# EAGLE design shield_mega_seed4_mpu_lobo5 (EAGLE 6.6.0)
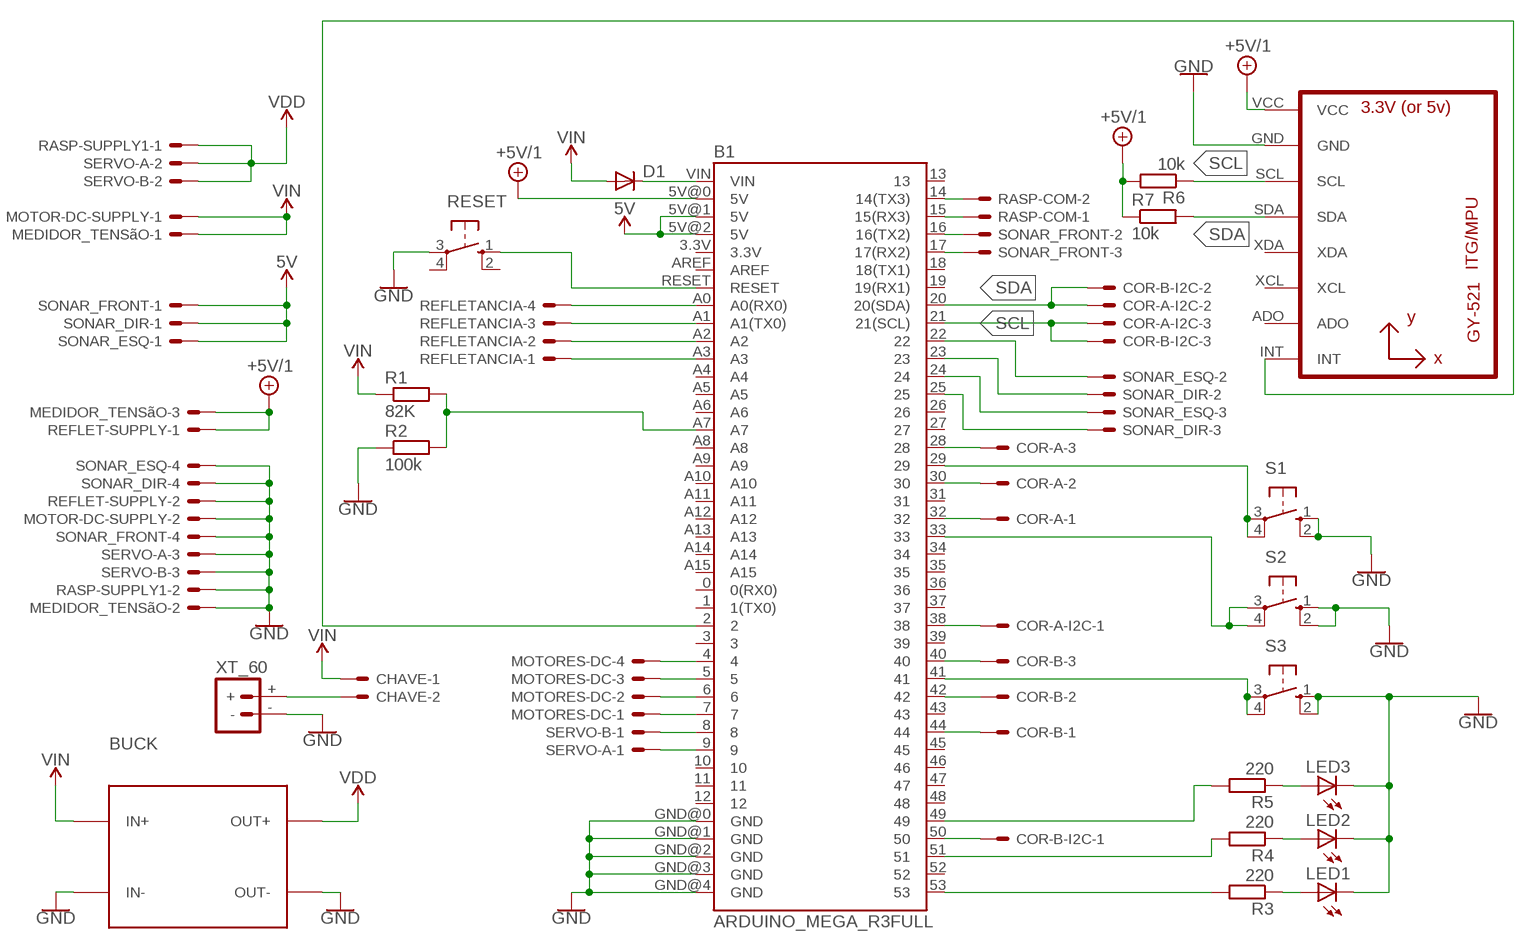
[diagram p0: schematic, sheet 1]

## Parts
B1  ARDUINO_MEGA_R3FULL  [ARDUINO_MEGA]
BUCK  DC-DC-STEP-DOWN-LM2596  [DC-DC-STEP-DOWN-LM2596]
CHAVE  22-23-2021  [22-23-2021]
COR-A  22-23-2031  [22-23-2031]
COR-A-I2C  22-23-2031  [22-23-2031]
COR-B  22-23-2031  [22-23-2031]
COR-B-I2C  22-23-2031  [22-23-2031]
D1  1N4004  [DO41-10]
LED1  LED5MM  [LED5MM]
LED2  LED5MM  [LED5MM]
LED3  LED5MM  [LED5MM]
MEDIDOR_TENSãO  22-23-2031  [22-23-2031]
MOTOR-DC-SUPPLY  22-23-2021  [22-23-2021]
MOTORES-DC  22-23-2041  [22-23-2041]
R1  82K  R-EU_0207/12  [0207/12]
R2  100k  R-EU_0207/12  [0207/12]
R3  220  R-EU_0207/7  [0207/7]
R4  220  R-EU_0207/7  [0207/7]
R5  220  R-EU_0207/7  [0207/7]
R6  10k  R-EU_0204/7  [0204/7]
R7  10k  R-EU_0204/7  [0204/7]
RASP-COM  22-23-2021  [22-23-2021]
RASP-SUPPLY1  22-23-2021  [22-23-2021]
REFLET-SUPPLY  22-23-2021  [22-23-2021]
REFLETANCIA  22-23-2041  [22-23-2041]
RESET  10-XX  [B3F-10XX]
S1  10-XX  [B3F-10XX]
S2  10-XX  [B3F-10XX]
S3  10-XX  [B3F-10XX]
SERVO-A  22-23-2031  [22-23-2031]
SERVO-B  22-23-2031  [22-23-2031]
SONAR_DIR  22-23-2041  [22-23-2041]
SONAR_ESQ  22-23-2041  [22-23-2041]
SONAR_FRONT  22-23-2041  [22-23-2041]
U1  GY-521MPU6050  [GY-521]
XT_60  BATTERY_CONNXT60  [XT60]

## Nets
5V: B1.5V@1(5V) B1.5V@2(5V) SONAR_DIR.1 SONAR_ESQ.1 SONAR_FRONT.1
+5V/1: B1.5V@0(5V) MEDIDOR_TENSãO.3 R6.2 R7.1 REFLET-SUPPLY.1 U1.VCC
GND: B1.GND@0(GND) B1.GND@1(GND) B1.GND@2(GND) B1.GND@3(GND) B1.GND@4(GND) BUCK.IN- BUCK.OUT- LED1.K(C) LED2.K(C) LED3.K(C) MEDIDOR_TENSãO.2 MOTOR-DC-SUPPLY.2 R2.1 RASP-SUPPLY1.2 REFLET-SUPPLY.2 RESET.3(P) S1.1(S) S1.2(S1) S2.1(S) S2.2(S1) S3.1(S) S3.2(S1) SERVO-A.3 SERVO-B.3 SONAR_DIR.4 SONAR_ESQ.4 SONAR_FRONT.4 U1.GND XT_60.-
N$1: B1.A2 REFLETANCIA.2
N$2: B1.A3 REFLETANCIA.1
N$3: B1.4 MOTORES-DC.4
N$4: B1.5 MOTORES-DC.3
N$5: B1.6 MOTORES-DC.2
N$6: B1.7 MOTORES-DC.1
N$7: B1.8 SERVO-B.1
N$8: B1.9 SERVO-A.1
N$9: B1.14(14(TX3)) RASP-COM.2
N$10: B1.15(15(RX3)) RASP-COM.1
N$11: B1.16(16(TX2)) SONAR_FRONT.2
N$12: B1.17(17(RX2)) SONAR_FRONT.3
N$13: CHAVE.2 XT_60.+
N$14: B1.32 COR-A.1
N$15: B1.30 COR-A.2
N$16: B1.38 COR-A-I2C.1
N$17: B1.40 COR-B.3
N$18: B1.42 COR-B.2
N$19: B1.44 COR-B.1
N$20: B1.A7 R1.2 R2.2
N$21: B1.53 R3.2
N$22: B1.51 R4.2
N$23: B1.49 R5.2
N$24: LED3.A R5.1
N$25: LED2.A R4.1
N$26: LED1.A R3.1
N$27: B1.33 S2.3(P) S2.4(P1)
N$28: B1.29 S1.3(P) S1.4(P1)
N$29: B1.A1(A1(TX0)) REFLETANCIA.3
N$30: B1.41 S3.3(P) S3.4(P1)
N$31: B1.RESET RESET.1(S)
N$32: B1.VIN D1.C
N$33: B1.A0(A0(RX0)) REFLETANCIA.4
N$34: B1.25 SONAR_DIR.3
N$35: B1.24 SONAR_ESQ.3
N$36: B1.23 SONAR_DIR.2
N$37: B1.22 SONAR_ESQ.2
N$39: B1.2 U1.INT
N$40: B1.50 COR-B-I2C.1
N$41: B1.28 COR-A.3
SCL: B1.21(21(SCL)) COR-A-I2C.3 COR-B-I2C.3 R6.1 U1.SCL
SDA: B1.20(20(SDA)) COR-A-I2C.2 COR-B-I2C.2 R7.2 U1.SDA
VDD: BUCK.OUT+ RASP-SUPPLY1.1 SERVO-A.2 SERVO-B.2
VIN: BUCK.IN+ CHAVE.1 D1.A MEDIDOR_TENSãO.1 MOTOR-DC-SUPPLY.1 R1.1
Unconnected: B1.0(0(RX0)) B1.1(1(TX0)) B1.3 B1.3.3V B1.10 B1.11 B1.12 B1.13 B1.18(18(TX1)) B1.19(19(RX1)) B1.26 B1.27 B1.31 B1.34 B1.35 B1.36 B1.37 B1.39 B1.43 B1.45 B1.46 B1.47 B1.48 B1.52 B1.A4 B1.A5 B1.A6 B1.A8 B1.A9 B1.A10 B1.A11 B1.A12 B1.A13 B1.A14 B1.A15 B1.AREF RESET.2(S1) RESET.4(P1) U1.ADO U1.XCL U1.XDA

## Library data of the parts
B1 = SparkFun-Boards3:ARDUINO_MEGA_R3: Arduino Mega R3 ATmega2560 R3 compatible footprint. SparkFun Products: Arduino Mega 2560 R3 <https://www.sparkfun.com/products/11061>
BUCK = 1484249208697-powermodules:DC-DC-STEP-DOWN-LM2596: DC/DC Step-Down Regulator based on LM2596-ADJ chip
CHAVE MOTOR-DC-SUPPLY RASP-COM RASP-SUPPLY1 REFLET-SUPPLY = con-molex:22-23-2021: .100" (2.54mm) Center Header - 2 Pin; MF: MOLEX; MPN: 22-23-2021; OC_FARNELL: 1462926; OC_NEWARK: 25C3832
COR-A COR-A-I2C COR-B COR-B-I2C MEDIDOR_TENSãO SERVO-A SERVO-B = con-molex:22-23-2031: .100" (2.54mm) Center Header - 3 Pin; MF: MOLEX; MPN: 22-23-2031; OC_FARNELL: 1462950; OC_NEWARK: 30C0862
D1 = diode:1N4004: DIODE general purpose rectifier, 1 A
LED1-LED3 = led:LED: LED OSRAM: - CHIPLED LG R971, LG N971, LY N971, LG Q971, LY Q971, LO R971, LY R971 LH N974, LH R974 LS Q976, LO Q976, LY Q976 LO Q996 - Hyper CHIPLED LW Q18S LB Q993, LB Q99A, LB R99A - SideLED LS A670, LO A670, LY A670, LG A670, LP A670 LB A673, LV A673, LT A673, LW A673 LH A674 LY A675 LS A676, LA A676, LO A676, LY A676, LW A676 LS A679, LY A679, LG A679 - Hyper Micro SIDELED® LS Y876, LA Y876, LO Y876, LY Y876 LT Y87S - SmartLED LW L88C, LW L88S LB L89C, LB L89S, LG L890 LS L89K, LO L89K, LY L89K LS L896, LA L896, LO L896, LY L896 - TOPLED LS T670, LO T670, LY T670, LG T670, LP T670 LSG T670, LSP T670, LSY T670, LOP T670, LYG T670 LG T671, LOG T671, LSG T671 LB T673, LV T673, LT T673, LW T673 LH T674 LS T676, LA T676, LO T676, LY T676, LB T676, LH T676, LSB T676, LW T676 LB T67C, LV T67C, LT T67C, LS T67K, LO T67K, LY T67K, LW E67C LS E67B, LA E67B, LO E67B, LY E67B, LB E67C, LV E67C, LT E67C LW T67C LS T679, LY T679, LG T679 LS T770, LO T770, LY T770, LG T770, LP T770 LB T773, LV T773, LT T773, LW T773 LH T774 LS E675, LA E675, LY E675, LS T675 LS T776, LA T776, LO T776, LY T776, LB T776 LHGB T686 LT T68C, LB T68C - Hyper Mini TOPLED® LB M676 - Mini TOPLED Santana® LG M470 LS M47K, LO M47K, LY M47K Source: http://www.osram.convergy.de LUXEON: - LUMILED® LXK2-PW12-R00, LXK2-PW12-S00, LXK2-PW14-U00, LXK2-PW14-V00 LXK2-PM12-R00, LXK2-PM12-S00, LXK2-PM14-U00 LXK2-PE12-Q00, LXK2-PE12-R00, LXK2-PE12-S00, LXK2-PE14-T00, LXK2-PE14-U00 LXK2-PB12-K00, LXK2-PB12-L00, LXK2-PB12-M00, LXK2-PB14-N00, LXK2-PB14-P00, LXK2-PB14-Q00 LXK2-PR12-L00, LXK2-PR12-M00, LXK2-PR14-Q00, LXK2-PR14-R00 LXK2-PD12-Q00, LXK2-PD12-R00, LXK2-PD12-S00 LXK2-PH12-R00, LXK2-PH12-S00 LXK2-PL12-P00, LXK2-PL12-Q00, LXK2-PL12-R00 Source: www.luxeon.com KINGBRIGHT: KA-3528ASYC Source: www.kingbright.com
MOTORES-DC REFLETANCIA SONAR_DIR SONAR_ESQ SONAR_FRONT = con-molex:22-23-2041: .100" (2.54mm) Center Header - 4 Pin; MF: MOLEX; MPN: 22-23-2041; OC_FARNELL: 1462920; OC_NEWARK: 38C0355
R1-R7 = rcl:R-EU_: RESISTOR, European symbol
RESET S1-S3 = switch-omron:10-XX: OMRON SWITCH; MPN: B3F-1000; OC_FARNELL: 176432; OC_NEWARK: 36M3542
U1 = gy-521:GY-521
XT_60 = Robotica-IFRN-SC-conectores:BATTERY_CONN: Battery Connectors Various footprints for battery connections

## Board
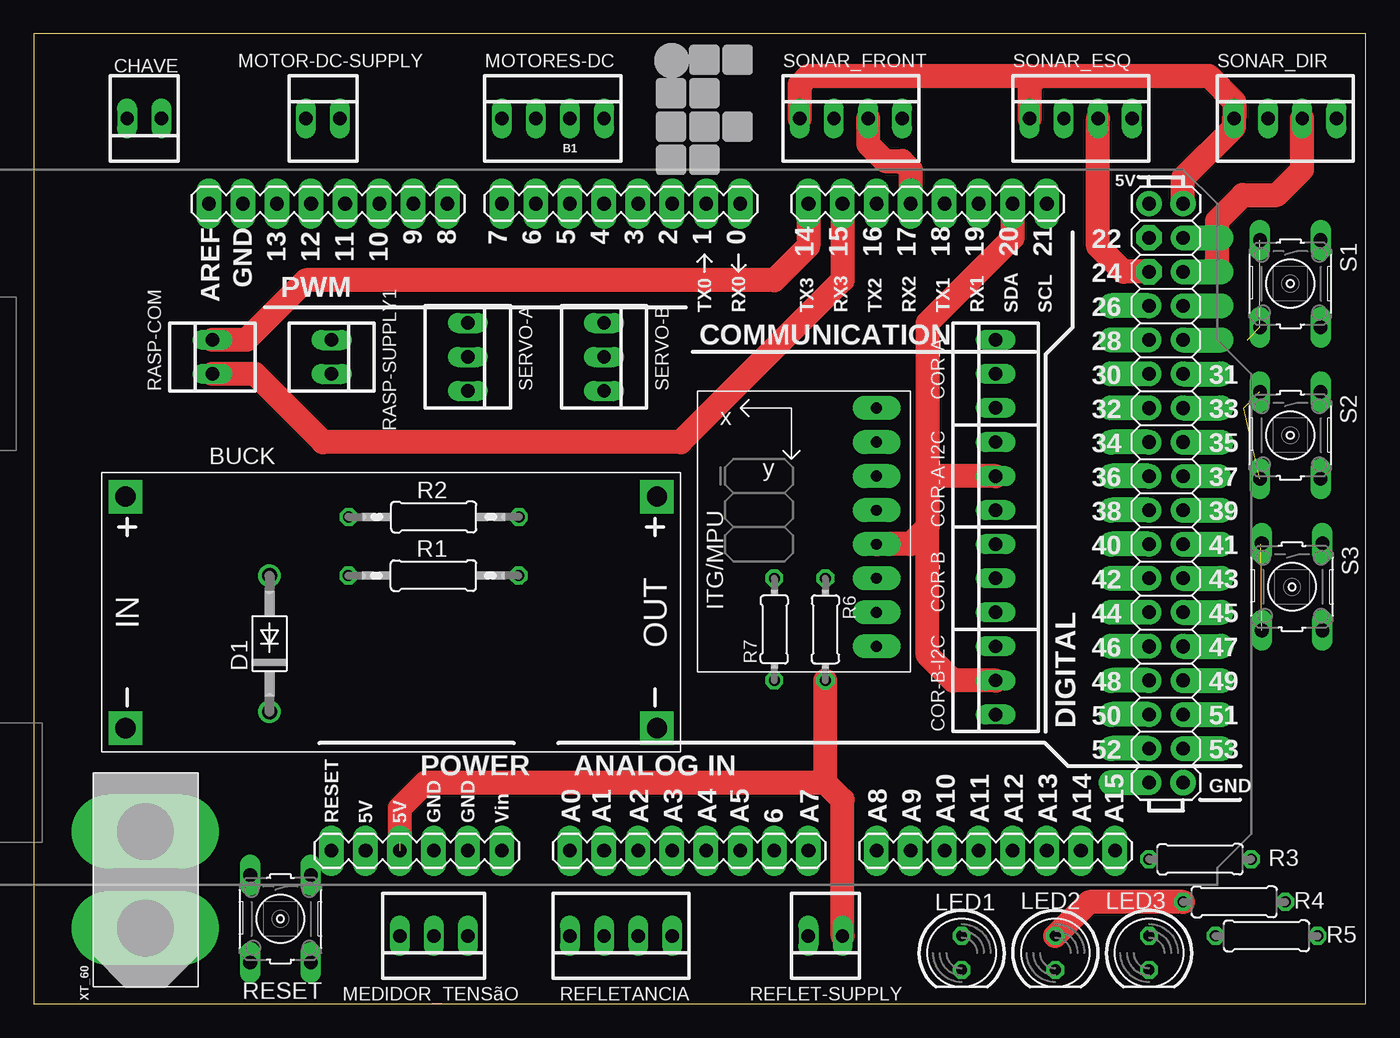
[diagram p1: board, top side]
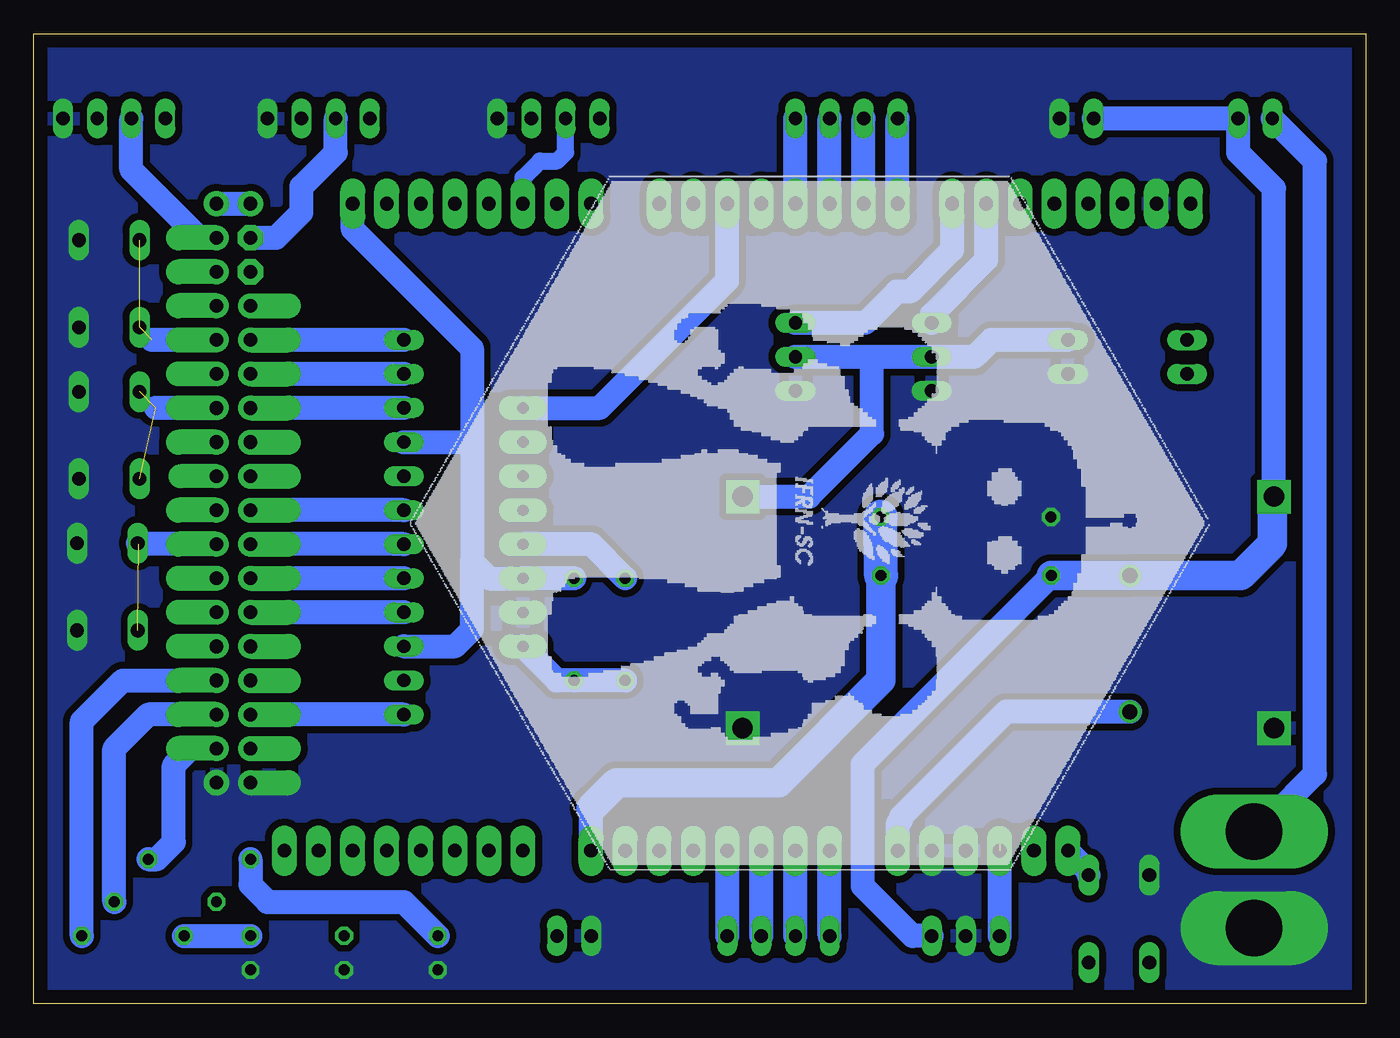
[diagram p2: board, bottom side, seen from below]

Size 99.37 x 72.38 mm. Coordinates in mm from the lower left corner, seen from the top.
Outline: 0,0 99.37,0 99.37,72.38 0,72.38 0,0
Copper layers (1*16): Top 0.035mm / dielectric 1.5mm / Bottom 0.035mm
Design rules "default *": minimum track width 30mil, minimum drill 24mil, track to track 20mil, track to pad 20mil, pad to pad 20mil, via to via 20mil, smd to smd 8mil, copper to edge 40mil, drill to drill 8mil, minimum pad ring 10mil, minimum via ring 8mil, stop-mask expansion 4mil, vias tented up to drill 0mil, thermal gap 0mil

### Footprints (pad centres in the part's own frame; a part is rotated, then mirrored left to right if it is on the bottom)
ARDUINO_MEGA = drill 1.016 pad 1.88 long: 0 13.97,24.13; 1 11.43,24.13; 2 8.89,24.13; 3 6.35,24.13; 3.3V -13.97,-24.13; 4 3.81,24.13; 5 1.27,24.13; 5V@0 -11.43,-24.13; 6 -1.27,24.13; 7 -3.81,24.13; 8 -7.874,24.13; 9 -10.414,24.13; 10 -12.954,24.13; 11 -15.494,24.13; 12 -18.034,24.13; 13 -20.574,24.13; 14 19.05,24.13; 15 21.59,24.13; 16 24.13,24.13; 17 26.67,24.13; 18 29.21,24.13; 19 31.75,24.13; 20 34.29,24.13; 21 36.83,24.13; A0 1.27,-24.13; A1 3.81,-24.13; A2 6.35,-24.13; A3 8.89,-24.13; A4 11.43,-24.13; A5 13.97,-24.13; A6 16.51,-24.13; A7 19.05,-24.13; A8 24.13,-24.13; A9 26.67,-24.13; A10 29.21,-24.13; A11 31.75,-24.13; A12 34.29,-24.13; A13 36.83,-24.13; A14 39.37,-24.13; A15 41.91,-24.13; AREF -25.654,24.13; GND@0 -8.89,-24.13; GND@1 -6.35,-24.13; GND@4 -23.114,24.13; RESET -16.51,-24.13; VIN -3.81,-24.13 | drill 1.016 pad 1.88: 5V@1 44.45,24.13; 5V@2 46.99,24.13; GND@3 46.99,-19.05 | drill 1.016 pad 1.88 octagon: 22 44.45,21.59; 24 44.45,19.05 | drill 1.016 pad 1.88 offset: 23 46.99,21.59; 25 46.99,19.05; 26 44.45,16.51; 27 46.99,16.51; 28 44.45,13.97; 29 46.99,13.97; 30 44.45,11.43; 31 46.99,11.43; 32 44.45,8.89; 33 46.99,8.89; 34 44.45,6.35; 35 46.99,6.35; 36 44.45,3.81; 38 44.45,1.27; 39 46.99,1.27; 40 44.45,-1.27; 41 46.99,-1.27; 42 44.45,-3.81; 43 46.99,-3.81; 44 44.45,-6.35; 45 46.99,-6.35; 46 44.45,-8.89; 47 46.99,-8.89; 48 44.45,-11.43; 49 46.99,-11.43; 50 44.45,-13.97; 51 46.99,-13.97; 52 44.45,-16.51; 53 46.99,-16.51; GND@2 44.45,-19.05 | drill 1 pad 1.778 offset: 37 46.99,3.81
DC-DC-STEP-DOWN-LM2596 = drill 1.5 pad 2.5 square: IN+ -19.812,8.636; IN- -19.812,-8.636; OUT+ 19.812,8.636; OUT- 19.812,-8.636
22-23-2021 = drill 1 long: 1 -1.27,0; 2 1.27,0
22-23-2031 = drill 1 long: 1 -2.54,0; 2 0,0; 3 2.54,0
DO41-10 = drill 1.118: A 5.08,0; C -5.08,0
LED5MM = drill 0.813 octagon: A -1.27,0; K 1.27,0
22-23-2041 = drill 1 long: 1 -3.81,0; 2 -1.27,0; 3 1.27,0; 4 3.81,0
0207/12 = drill 0.813 octagon: 1 -6.35,0; 2 6.35,0
0207/7 = drill 0.813 octagon: 1 -3.81,0; 2 3.81,0
0204/7 = drill 0.813 octagon: 1 -3.81,0; 2 3.81,0
B3F-10XX = drill 1.016 long: 1 -3.251,2.261; 2 3.251,2.261; 3 -3.251,-2.261; 4 3.251,-2.261
GY-521 = drill 0.8 pad 1.778 long: ADO -8.89,-6.35; GND -8.89,6.35; INT -8.89,-8.89; SCL -8.89,3.81; SDA -8.89,1.27; VCC -8.89,8.89; XCL -8.89,-3.81; XDA -8.89,-1.27
XT60 = drill 4.2 pad 5.5 long: + 6.51,-1.35; - -0.69,-1.35

### Placement (x,y rotation side)
B1  38.73,35.56 0 top
BUCK  26.67,29.21 0 top
CHAVE  8.26,66.04 180 top
COR-A  71.76,46.99 90 top
COR-A-I2C  71.76,39.37 90 top
COR-B  71.76,31.75 90 top
COR-B-I2C  71.76,24.13 90 top
D1  17.6,26.87 90 top
LED1  69.22,3.81 270 top
LED2  76.2,3.81 270 top
LED3  83.19,3.81 270 top
MEDIDOR_TENSãO  29.85,5.08 180 top
MOTOR-DC-SUPPLY  21.59,66.04 0 top
MOTORES-DC  38.73,66.04 0 top
R1  29.82,31.95 0 top
R2  29.85,36.32 0 top
R3  87,10.79 0 top
R4  89.54,7.62 0 top
R5  91.95,5.08 0 top
R6  59.05,27.94 270 top
R7  55.24,27.94 90 top
RASP-COM  13.33,48.26 90 top
RASP-SUPPLY1  22.23,48.26 270 top
REFLET-SUPPLY  59.05,5.08 180 top
REFLETANCIA  43.81,5.08 180 top
RESET  18.42,6.35 270 top
S1  93.73,53.72 270 top
S2  93.73,42.42 270 top
S3  93.85,31.12 270 top
SERVO-A  32.38,48.26 270 top
SERVO-B  42.54,48.26 270 top
SONAR_DIR  93.34,66.04 0 top
SONAR_ESQ  78.11,66.04 0 top
SONAR_FRONT  60.96,66.04 0 top
U1  53.98,35.56 180 top
XT_60  6.98,6.35 90 top

### Tracks (layer width: path | path; a pad name or v marks a point on that pad's centre or on a via)
5V
  Top 1.778: B1.5V@2 85.73,61.59 89.54,65.41 SONAR_DIR.1 89.54,67.31 87.63,69.22 74.93,69.22 74.61,68.9 | SONAR_ESQ.1 74.3,68.58 74.61,68.9 | 74.61,68.9 74.3,69.22 57.78,69.22 57.15,68.58 SONAR_FRONT.1
  Bottom 1.778: B1.5V@2 B1.5V@1
+5V/1  (1 unrouted)
  Top 1.778: REFLET-SUPPLY.1 60.32,15.24 59.05,16.51 | 59.05,16.51 29.21,16.51 27.31,14.61 B1.5V@0 | 59.05,16.51 R6.2
  Bottom 1.778: MEDIDOR_TENSãO.3 27.31,12.06 | U1.VCC 60.32,24.13 R6.2 R7.1
GND
  Bottom 1.778: B1.GND@3 85.78,16.46
  pour Bottom: 0.64,72.39 0.64,0 99.06,0 99.06,72.39
N$1
  Bottom 1.778: REFLETANCIA.2 B1.A2
N$2
  Bottom 1.778: REFLETANCIA.1 B1.A3
N$3
  Bottom 1.778: B1.4 MOTORES-DC.4
N$4
  Bottom 1.778: B1.5 MOTORES-DC.3
N$5
  Bottom 1.778: B1.6 MOTORES-DC.2
N$6
  Bottom 1.778: B1.7 MOTORES-DC.1
N$7
  Bottom 1.778: B1.8 30.86,56.26 33.97,53.15 34.99,53.15 37.34,50.8 SERVO-B.1
N$8
  Bottom 1.778: SERVO-A.1 32.38,51.44 28.32,55.5 B1.9
N$9
  Top 1.778: RASP-COM.2 15.88,49.53 20.32,53.98 55.24,53.98 57.78,56.52 B1.14
N$10
  Top 1.778: B1.15 60.32,53.98 48.26,41.91 21.59,41.91 16.51,46.99 RASP-COM.1
N$11
  Bottom 1.27: B1.16 62.86,61.59 61.59,62.86 60.32,62.86 59.69,63.5 SONAR_FRONT.2
N$12
  Top 1.778: SONAR_FRONT.3 62.23,64.14 63.5,62.86 64.77,62.86 65.41,62.23 B1.17
N$13
  Bottom 1.778: 6.98,13.97 3.81,17.14 3.81,62.86 CHAVE.2
  Bottom 1.93: XT_60.+ 6.98,13.97
N$14
  Bottom 1.778: COR-A.1 B1.32
N$15
  Bottom 1.778: COR-A.2 B1.30
N$16
  Bottom 1.778: COR-A-I2C.1 B1.38
N$17
  Bottom 1.778: COR-B.3 B1.40
N$18
  Bottom 1.778: COR-B.2 B1.42
N$19
  Bottom 1.778: COR-B.1 B1.44
N$20
  Bottom 1.778: B1.A7 57.78,14.61
  Bottom 2.184: 57.78,14.61 55.88,16.51 43.81,16.51 36.17,24.16 R1.2
  Bottom 2.54: R1.2 R2.2
N$21
  Bottom 1.778: R3.2 90.17,10.79 88.9,12.06 88.9,17.78 87.63,19.05 B1.53
N$22
  Bottom 1.778: R4.2 93.34,19.05 90.81,21.59 B1.51
N$23
  Bottom 1.778: B1.49 92.71,24.13 95.76,21.08 R5.2
N$24
  Bottom 1.778: R5.1 LED3.A
N$25
  Top 1.778: R4.1 78.74,7.62 LED2.A
N$26
  Bottom 1.778: R3.1 83.19,8.89 81.92,7.62 71.76,7.62 LED1.A
N$27  (2 unrouted)
  Bottom 1.778: B1.33 90.25,44.45
N$28  (2 unrouted)
  Bottom 1.778: B1.29 90.53,49.53
N$29
  Bottom 1.778: REFLETANCIA.3 B1.A1
N$30  (1 unrouted)
  Bottom 1.778: B1.41 91.52,34.29 S3.3
N$31
  Bottom 1.778: B1.RESET 20.96,10.16 RESET.1
N$32
  Bottom 1.778: D1.C 26.85,21.79 34.67,13.97 34.67,13.72 34.92,13.46 B1.VIN
N$33
  Bottom 1.778: REFLETANCIA.4 B1.A0
N$34
  Top 1.778: B1.25 87.63,54.61 88.27,55.25 88.27,58.42 90.17,60.33 92.71,60.33 94.62,62.23 SONAR_DIR.3
N$35
  Top 1.778: B1.24 81.28,54.61 79.38,56.52 SONAR_ESQ.3
N$36
  Bottom 1.778: B1.23 87,57.15 92.08,62.23 SONAR_DIR.2
N$37
  Bottom 1.778: B1.22 81.28,57.15 79.38,59.05 79.38,60.96 76.84,63.5 SONAR_ESQ.2
N$39
  Bottom 1.778: U1.INT 57.15,44.45 47.62,53.98 B1.2
N$40
  Bottom 1.778: COR-B-I2C.1 B1.50
N$41
  Bottom 1.778: COR-A.3 B1.28
SCL
  Bottom 1.778: 66.68,41.91 66.68,48.89 75.57,57.78 B1.21 | 66.68,41.91 66.68,33.02 | 66.68,33.02 65.41,31.75 U1.SCL R6.1 | 66.68,33.02 66.68,27.94 67.95,26.67 COR-B-I2C.3 | COR-A-I2C.3 66.68,41.91
SDA
  Top 1.778: 66.68,39.37 66.68,50.8 73.03,57.15 B1.20 | 66.68,39.37 66.68,35.56 | 66.68,35.56 65.41,34.29 U1.SDA | 66.68,35.56 66.68,26.03 68.58,24.13 COR-B-I2C.2 | COR-A-I2C.2 66.68,39.37
  Bottom 1.778: R7.2 57.78,34.29 U1.SDA
VDD
  Bottom 1.778: RASP-SUPPLY1.1 27.94,49.53 29.21,48.26 SERVO-A.2 36.83,48.26 | 36.83,48.26 SERVO-B.2 | 36.83,48.26 36.83,42.55 41.53,37.85 BUCK.OUT+
VIN
  Bottom 1.778: MOTOR-DC-SUPPLY.1 CHAVE.1 9.53,63.5 6.86,60.83 BUCK.IN+ | MEDIDOR_TENSãO.1 33.81,5.08 37.52,8.79 37.52,17.91 R1.1
  Bottom 2.184: BUCK.IN+ 6.98,37.72 6.98,34.29 9.32,31.95 D1.A R1.1